# EAGLE design pico_pad (EAGLE 9.6.2)
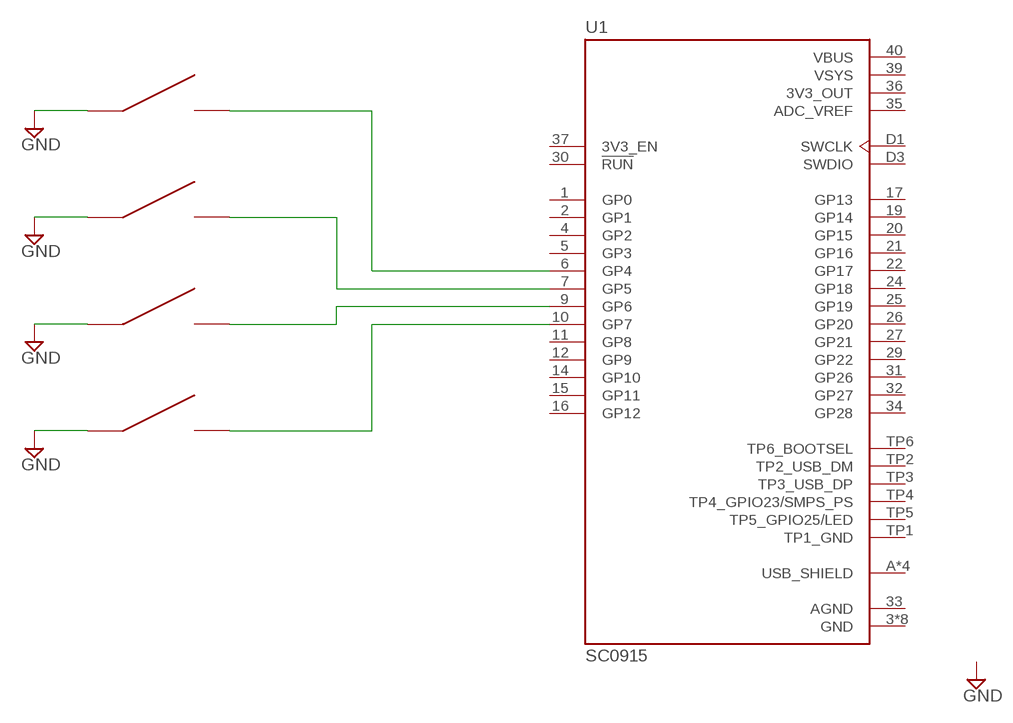
[diagram p0: schematic, sheet 1]

## Parts
U1  SC0915  [MODULE_SC0915]
U$1  PTS526_TACT  [PTS526_TACT]
U$2  PTS526_TACT  [PTS526_TACT]
U$3  PTS526_TACT  [PTS526_TACT]
U$4  PTS526_TACT  [PTS526_TACT]

## Nets
GND: U$1.A1(A) U$1.A2(A) U$2.A1(A) U$2.A2(A) U$3.A1(A) U$3.A2(A) U$4.A1(A) U$4.A2(A)
N$1: U1.6(GP4) U$2.B1(B) U$2.B2(B)
N$2: U1.7(GP5) U$3.B1(B) U$3.B2(B)
N$3: U1.9(GP6) U$1.B1(B) U$1.B2(B)
N$4: U1.10(GP7) U$4.B1(B) U$4.B2(B)
Unconnected: U1.1(GP0) U1.2(GP1) U1.4(GP2) U1.5(GP3) U1.11(GP8) U1.12(GP9) U1.14(GP10) U1.15(GP11) U1.16(GP12) U1.17(GP13) U1.19(GP14) U1.20(GP15) U1.21(GP16) U1.22(GP17) U1.24(GP18) U1.25(GP19) U1.26(GP20) U1.27(GP21) U1.29(GP22) U1.30(!RUN) U1.31(GP26) U1.32(GP27) U1.34(GP28) U1.37(3V3_EN) U1.D1(SWCLK) U1.D3(SWDIO) U1.TP2(TP2_USB_DM) U1.TP3(TP3_USB_DP) U1.TP4(TP4_GPIO23/SMPS_PS) U1.TP5(TP5_GPIO25/LED) U1.TP6(TP6_BOOTSEL)

## Power pins joined to a net without a drawn wire
3V3_OUT: U1.36(3V3_OUT)
ADC_VREF: U1.35(ADC_VREF)
AGND: U1.33(AGND)
GND: U1.3(GND) U1.8(GND) U1.13(GND) U1.18(GND) U1.23(GND) U1.28(GND) U1.38(GND) U1.D2(GND)
TP1_GND: U1.TP1(TP1_GND)
USB_SHIELD: U1.A(USB_SHIELD) U1.B(USB_SHIELD) U1.C(USB_SHIELD) U1.D(USB_SHIELD)
VBUS: U1.40(VBUS)
VSYS: U1.39(VSYS)

## Library data of the parts
U1 = macroLib:SC0915: RP2040 Raspberry Pi Pico - ARM Cortex-M0+ MCU 32-Bit Embedded Evaluation Board Check availability <https://pricing.snapeda.com/parts/SC0915/Raspberry%20Pi/view-part?ref=eda>; AVAILABILITY: In Stock; DESCRIPTION: RP2040 Raspberry Pi Pico series ARM® Cortex®-M0+ MCU 32-Bit Embedded Evaluation Board; MF: Raspberry Pi; MP: SC0915; PACKAGE: None; PRICE: None; PURCHASE-URL: https://pricing.snapeda.com/search/part/SC0915/?ref=eda
U$1-U$4 = macroLib:PTS526_TACT

## Board
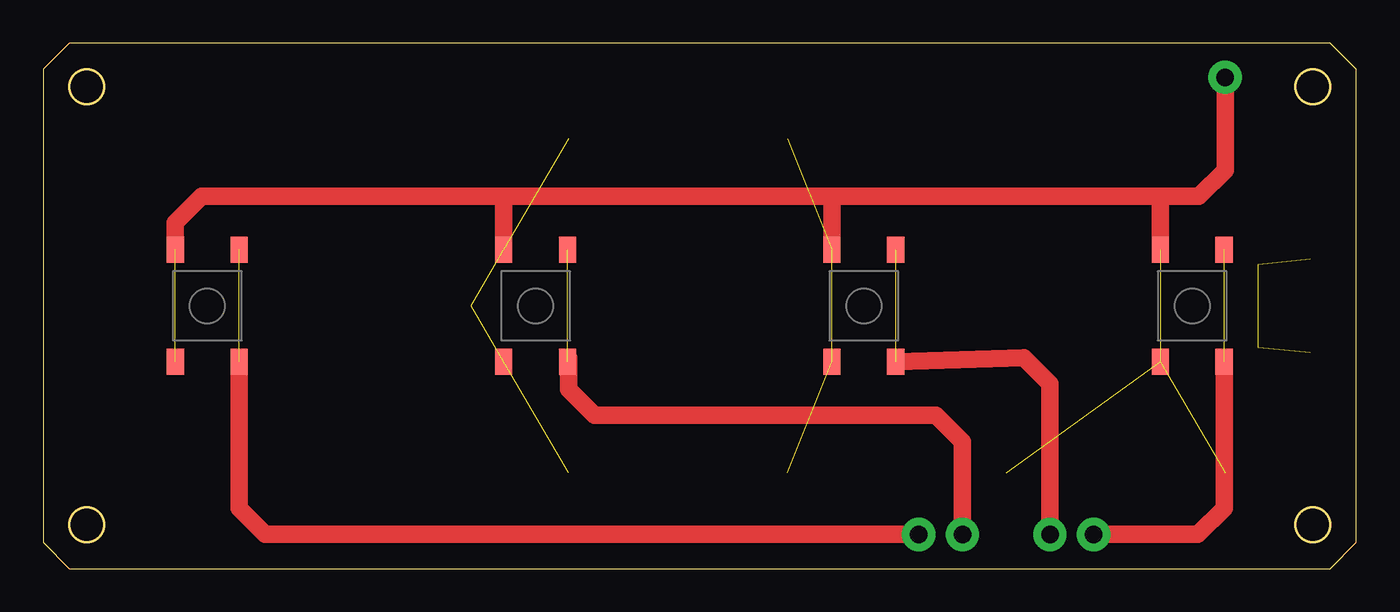
[diagram p1: board, top side]
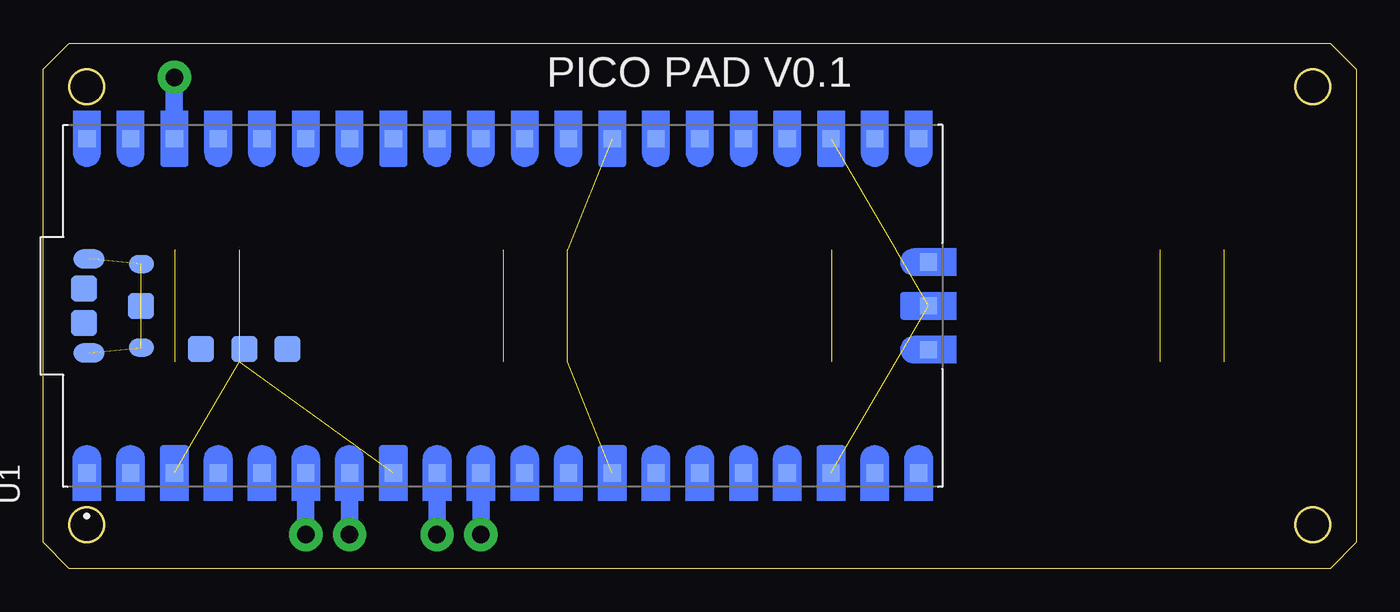
[diagram p2: board, bottom side, seen from below]

Size 76.2 x 30.48 mm. Coordinates in mm from the lower left corner, seen from the top.
Outline: 0,28.96 0,1.52 1.52,0 74.68,0 76.2,1.52 76.2,28.96 74.68,30.48 1.52,30.48 0,28.96
Outline: circle at 2.54,27.94 radius 1
Outline: circle at 2.54,2.54 radius 1
Outline: circle at 73.66,27.94 radius 1
Outline: circle at 73.66,2.54 radius 1
Copper layers (1*16): Top 0.035mm / dielectric 1.5mm / Bottom 0.035mm
Design rules "default": minimum track width 6mil, minimum drill 0.35mm, track to track 6mil, track to pad 6mil, pad to pad 6mil, via to via 6mil, smd to smd 6mil, copper to edge 40mil, drill to drill 6mil, minimum pad ring 10mil, minimum via ring 8mil, stop-mask expansion 4mil, vias tented up to drill 0mil, thermal gap 10mil

### Footprints (pad centres in the part's own frame; a part is rotated, then mirrored left to right if it is on the bottom)
MODULE_SC0915 = smd 1 x 1: 1 -9.69,24.13; 2 -9.69,21.59; 3 -9.69,19.05; 4 -9.69,16.51; 5 -9.69,13.97; 6 -9.69,11.43; 7 -9.69,8.89; 8 -9.69,6.35; 9 -9.69,3.81; 10 -9.69,1.27; 11 -9.69,-1.27; 12 -9.69,-3.81; 13 -9.69,-6.35; 14 -9.69,-8.89; 15 -9.69,-11.43; 16 -9.69,-13.97; 17 -9.69,-16.51; 18 -9.69,-19.05; 19 -9.69,-21.59; 20 -9.69,-24.13; 21 9.69,-24.13; 22 9.69,-21.59; 23 9.69,-19.05; 24 9.69,-16.51; 25 9.69,-13.97; 26 9.69,-11.43; 27 9.69,-8.89; 28 9.69,-6.35; 29 9.69,-3.81; 30 9.69,-1.27; 31 9.69,1.27; 32 9.69,3.81; 33 9.69,6.35; 34 9.69,8.89; 35 9.69,11.43; 36 9.69,13.97; 37 9.69,16.51; 38 9.69,19.05; 39 9.69,21.59; 40 9.69,24.13; D1 -2.54,-24.7; D2 0,-24.7; D3 2.54,-24.7 | smd 1.1 x 1.8: A -2.725,24; B 2.725,24 | smd 1.05 x 1.45: C -2.425,20.97; D 2.425,20.97 | smd 1.5 x 1.5: TP1 0,21; TP2 1,24.3; TP3 -1,24.3; TP4 -2.5,17.5; TP5 -2.5,15; TP6 -2.5,12.5
PTS526_TACT = smd 1.5 x 1: A1 -3.25,1.85; A2 3.25,1.85; B1 -3.25,-1.85; B2 3.25,-1.85

### Placement (x,y rotation side)
U1  49.53,15.24 90 bottom
U$1  28.57,15.24 90 top
U$2  66.67,15.24 90 top
U$3  47.62,15.24 90 top
U$4  9.53,15.24 90 top

### Tracks (layer width: path | path; a pad name or v marks a point on that pad's centre or on a via)
GND  (via drill 1.02 pad 1.93)  (11 unrouted)
  Top 1.016: U$4.A2 7.67,20.07 9.2,21.59 26.73,21.59 | U$2.A2 64.83,21.59 | 26.73,21.59 45.77,21.59 | 64.83,21.59 45.77,21.59 | U$3.A2 45.77,21.59 | U$1.A2 26.73,21.59 | v68.58,28.5 68.58,23.11 67.06,21.59 64.83,21.59
  Bottom 1.016: U1.38 v68.58,28.5
N$1  (via drill 1.02 pad 1.93)  (1 unrouted)
  Top 1.016: U$2.B1 68.53,3.5 67,1.98 v60.96,1.98
  Bottom 1.016: U1.6 v60.96,1.98
N$2  (via drill 1.02 pad 1.93)  (1 unrouted)
  Top 1.016: U$3.B1 56.9,12.24 58.42,10.72 v58.42,1.98
  Bottom 1.016: U1.7 v58.42,1.98
N$3  (via drill 1.02 pad 1.93)  (1 unrouted)
  Top 1.016: U$1.B1 30.48,12.24 30.48,10.41 32,8.89 51.82,8.89 53.34,7.37 v53.34,1.98
  Bottom 1.016: U1.9 v53.34,1.98
N$4  (via drill 1.02 pad 1.93)  (1 unrouted)
  Top 1.016: U$4.B1 11.38,3.5 12.9,1.98 v50.8,1.98
  Bottom 1.016: U1.10 v50.8,1.98
USB_SHIELD  (3 unrouted)

### Text on the board
bPlace: PICO PAD V0.1